# EAGLE schematic APRS module (EAGLE 6.4)
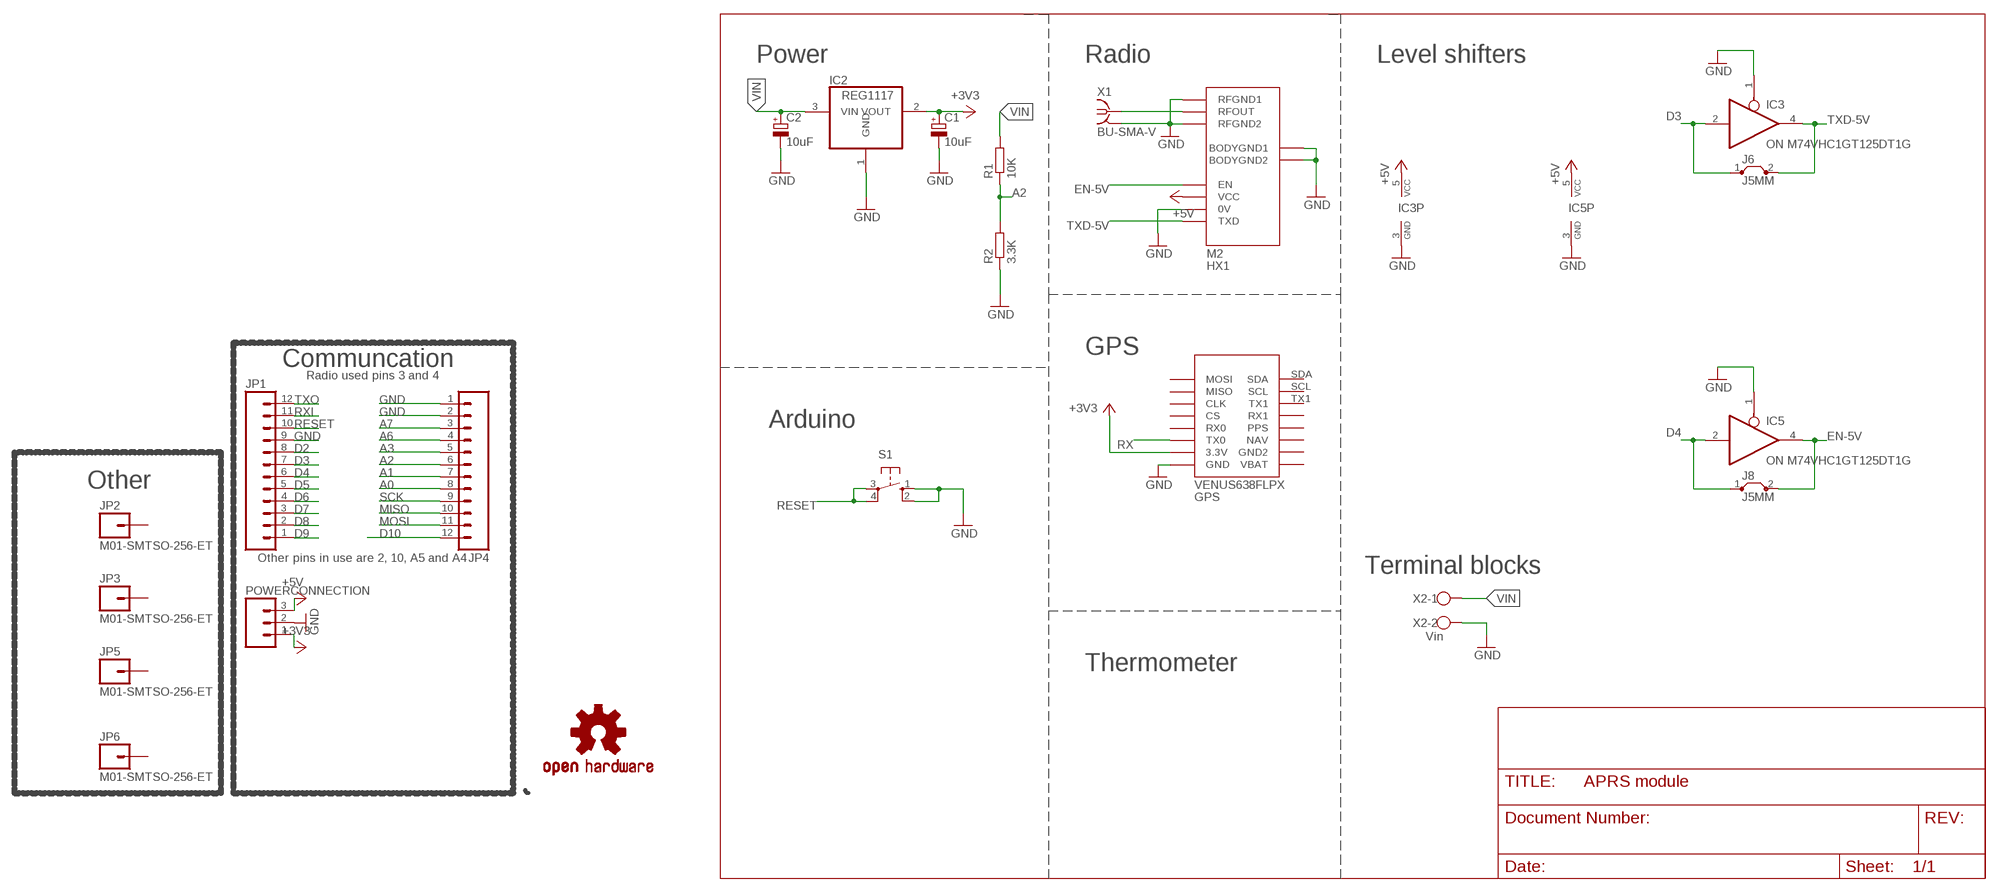
[diagram p0: schematic, sheet 1]

## Parts
C1  10uF  CPOL-EUE2.5-5  [E2,5-5]
C2  10uF  CPOL-EUE2.5-5  [E2,5-5]
GPS  VENUS638FLPX  [VENUS638FLPX]
IC2  REG1117  [SOT223]
IC3  ON M74VHC1GT125DT1G  74AHC1G125DBV  [SOT23-5]
IC5  ON M74VHC1GT125DT1G  74AHC1G125DBV  [SOT23-5]
J6  J5MM  [05]
J8  J5MM  [05]
JP1  M12PTH  [1X12]
JP2  M01-SMTSO-256-ET  [SMTSO-256-ET]
JP3  M01-SMTSO-256-ET  [SMTSO-256-ET]
JP4  M12PTH  [1X12]
JP5  M01-SMTSO-256-ET  [SMTSO-256-ET]
JP6  M01-SMTSO-256-ET  [SMTSO-256-ET]
LOGO1  OSHW-LOGOL  [OSHW-LOGO-L]
M2  HX1  [HX1]
POWERCONNECTION  M03PTH  [1X03]
R1  10K  R-EU_R1206  [R1206]
R2  3.3K  R-EU_R1206  [R1206]
S1  10-XX  [B3F-10XX]
X1  BU-SMA-V  [BU-SMA-V]
X2  Vin  W237-102  [W237-102]

## Nets
+3V3: C1.+ GPS.3.3V IC2.2(VOUT) POWERCONNECTION.1
+5V: IC3.5(VCC) IC5.5(VCC) M2.VCC POWERCONNECTION.3
A0: JP4.8
A1: JP4.7
A2: JP4.6 R1.1 R2.2
A3: JP4.5
A6: JP4.4
A7: JP4.3
D2: JP1.8
D3: IC3.2(I) J6.1 JP1.7
D4: IC5.2(I) J8.1 JP1.6
D5: JP1.5
D6: JP1.4
D7: JP1.3
D8: JP1.2
D9: JP1.1
D10: JP4.12
EN-5V: IC5.4(O) J8.2 M2.EN
GND [vcc]: C1.- C2.- GPS.GND IC2.1(GND) IC3.1(OE) IC3.3(GND) IC5.1(OE) IC5.3(GND) JP1.9 JP4.1 JP4.2 M2.0V M2.BODYGND1 M2.BODYGND2 M2.RFGND1 M2.RFGND2 POWERCONNECTION.2 R2.1 S1.1(S) S1.2(S1) X1.2(GND) X2.2
MISO: JP4.10
MOSI: JP4.11
RESET: JP1.10 S1.3(P) S1.4(P1)
RFOUT [20]: M2.RFOUT X1.1
RX: GPS.TX0
RXI: JP1.11
SCK: JP4.9
TXD-5V: IC3.4(O) J6.2 M2.TXD
TXO: JP1.12
VIN [30]: C2.+ IC2.3(VIN) R1.2 X2.1
Unconnected: GPS.CLK GPS.CS GPS.GND2 GPS.MISO GPS.MOSI GPS.NAV GPS.PPS GPS.RX0 GPS.RX1 GPS.SCL GPS.SDA GPS.TX1 GPS.VBAT JP2.P$1 JP3.P$1 JP5.P$1 JP6.P$1

## Notes on the sheet
- Power | Radio | Level shifters
- GPS
- Communcation
- Radio used pins 3 and 4
- Arduino
- Other
- Other pins in use are 2, 10, A5 and A4
- Terminal blocks
- Thermometer

## Power pins joined to a net without a drawn wire
GND: X1.3(GND) X1.4(GND) X1.5(GND)

## Library data of the parts
C1 C2 = rcl:CPOL-EU: POLARIZED CAPACITOR, European symbol
GPS = trackuino:VENUS638FLPX
IC2 = burr-brown:REG1117: 800mA and 1A Low Dropout (LDO) Positive Regulator 1.8V, 2.5V, 2.85V, 3.3V, 5V, and Adj; MPN: REG1117; OC_FARNELL: 1097566; OC_NEWARK: 14P6981
IC3 IC5 = 74xx-little-us:74*1G125: Single Bus Buffer Gate with 3-State Output
J6 J8 = jumper:J: Bridge
JP1 JP4 = SparkFun:M12: Header 12 Standard 12-pin 0.1" header. Use with straight break away headers (SKU : PRT-00116), right angle break away headers (PRT-00553), swiss pins (PRT-00743), machine pins (PRT-00117), and female headers (PRT-00115).
JP2 JP3 JP5 JP6 = SparkFun-Connectors:M01: Header 1 Standard 1-pin 0.1" header. Use with straight break away headers (SKU : PRT-00116), right angle break away headers (PRT-00553), swiss pins (PRT-00743), machine pins (PRT-00117), and female headers (PRT-00115).
LOGO1 = SparkFun-Aesthetics:OSHW-LOGO: Open Source Hardware Logo This logo indicates the piece of hardware it is found on incorporates a OSHW license and/or adheres to the definition of open source hardware found here: http://freedomdefined.org/OSHW
M2 = trackuino:HX1
POWERCONNECTION = SparkFun-Connectors:M03: Header 3 Standard 3-pin 0.1" header. Use with straight break away headers (SKU : PRT-00116), right angle break away headers (PRT-00553), swiss pins (PRT-00743), machine pins (PRT-00117), and female headers (PRT-00115). Molex polarized connector foot print use with SKU : PRT-08232 with associated crimp pins and housings.
R1 R2 = resistor:R-EU_: RESISTOR, European symbol
S1 = switch-omron:10-XX: OMRON SWITCH
X1 = con-coax:BU-SMA-V: FEMALE SMA CONNECTOR Radiall distributor RS 112-3794; OC_FARNELL: unknown; OC_NEWARK: unknown
X2 = con-wago-500:W237-102: WAGO SCREW CLAMP; MPN: 237-102; OC_FARNELL: unknown; OC_NEWARK: 70K9898

## Net classes
0 10: width 0.254 mm
1 vcc: width 0.254 mm
2 20: width 0.508 mm
3 30: width 0.762 mm